# EAGLE design lixie_usb (EAGLE 7.6.0)
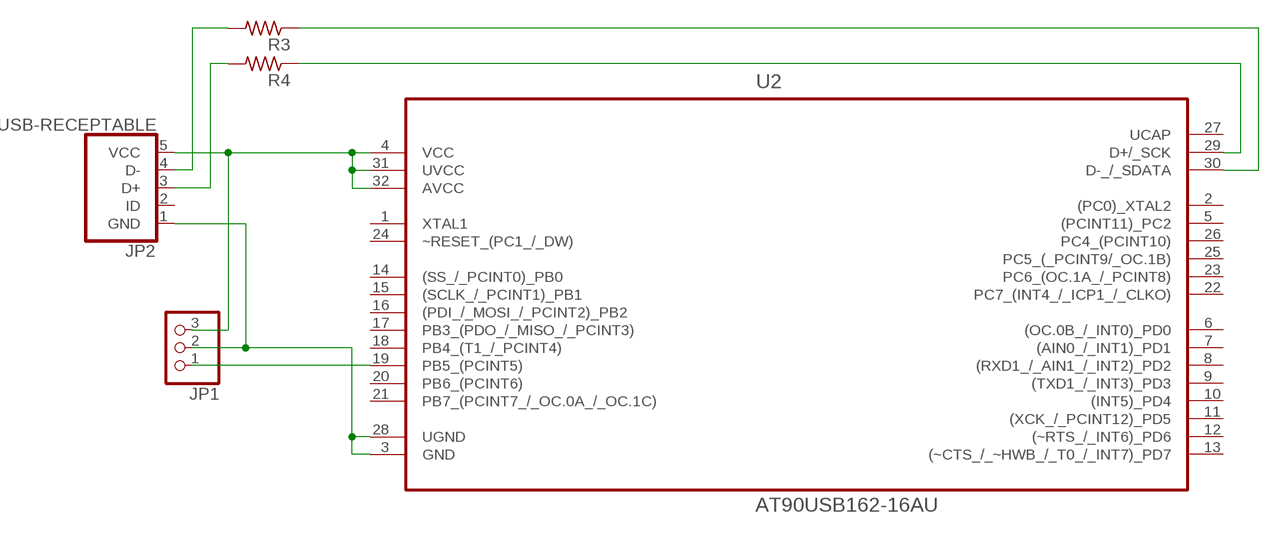
[diagram p0: schematic, sheet 1]

## Parts
JP1  PINHD-1X3  [1X03]
JP2  USB-RECEPTABLE  [FCI-10103594-0001LF]
R3  R-US_R0805  [R0805]
R4  R-US_R0805  [R0805]
U2  AT90USB162-16AU  [QFP80P900X900X120-32N]

## Nets
GND: JP1.2 JP2.1(GND) U2.3(GND) U2.28(UGND)
N$1: R3.1 U2.30(D-_/_SDATA)
N$4: JP2.4(D-) R3.2
N$5: JP2.3(D+) R4.2
N$7: R4.1 U2.29(D+/_SCK)
N$20: JP1.3 JP2.5(VCC) U2.4(VCC) U2.31(UVCC) U2.32(AVCC)
N$23: JP1.1 U2.19(PB5_(PCINT5))
Unconnected: JP2.2(ID) U2.1(XTAL1) U2.2((PC0)_XTAL2) U2.5((PCINT11)_PC2) U2.6((OC.0B_/_INT0)_PD0) U2.7((AIN0_/_INT1)_PD1) U2.8((RXD1_/_AIN1_/_INT2)_PD2) U2.9((TXD1_/_INT3)_PD3) U2.10((INT5)_PD4) U2.11((XCK_/_PCINT12)_PD5) U2.12((~RTS_/_INT6)_PD6) U2.13((~CTS_/_~HWB_/_T0_/_INT7)_PD7) U2.14((SS_/_PCINT0)_PB0) U2.15((SCLK_/_PCINT1)_PB1) U2.16((PDI_/_MOSI_/_PCINT2)_PB2) U2.17(PB3_(PDO_/_MISO_/_PCINT3)) U2.18(PB4_(T1_/_PCINT4)) U2.20(PB6_(PCINT6)) U2.21(PB7_(PCINT7_/_OC.0A_/_OC.1C)) U2.22(PC7_(INT4_/_ICP1_/_CLKO)) U2.23(PC6_(OC.1A_/_PCINT8)) U2.24(~RESET_(PC1_/_DW)) U2.25(PC5_(_PCINT9/_OC.1B)) U2.26(PC4_(PCINT10)) U2.27(UCAP)

## Library data of the parts
JP1 = adafruit:PINHD-1X3: PIN HEADER
JP2 = daspilker:USB-RECEPTABLE: USB Receptable
R3 R4 = resistor:R-US_: RESISTOR, American symbol
U2 = Atmel_By_element14_Batch_1-00:AT90USB162-16AU: 8-bit Microcontroller; MPN: AT90USB162-16AU; OC_FARNELL: 1455073; OC_NEWARK: 58M3868; PACKAGE: TQFP-32; SUPPLIER: Atmel

## Board
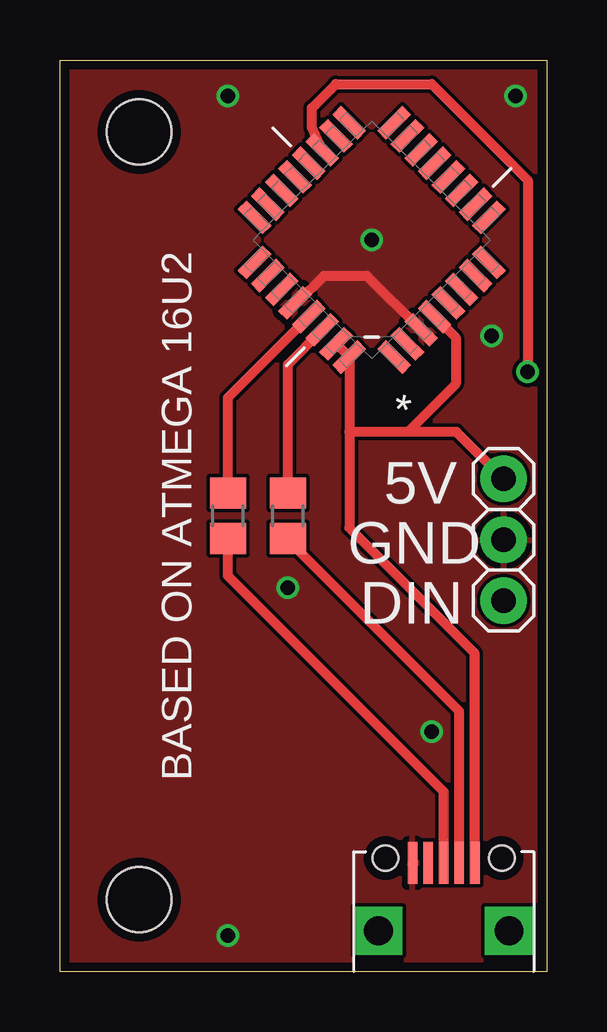
[diagram p1: board, top side]
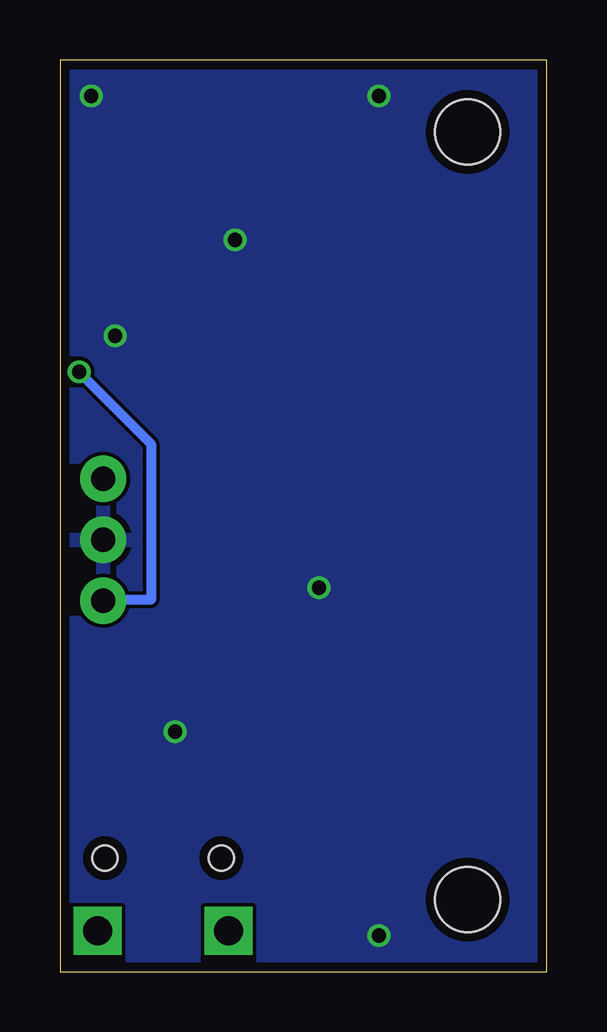
[diagram p2: board, bottom side, seen from below]

Size 20.3 x 38 mm. Coordinates in mm from the lower left corner, seen from the top.
Outline: 0,0 0,38 20.3,38 20.3,0 0,0
Copper layers (1*16): Top 0.0356mm / dielectric 1.5011mm / Bottom 0.0356mm
Design rules "LaenPCBOrder": minimum track width 6mil, minimum drill 13mil, track to track 6mil, track to pad 6mil, pad to pad 6mil, via to via 6mil, smd to smd 6mil, copper to edge 15mil, drill to drill 6mil, minimum pad ring 7mil, minimum via ring 7mil, stop-mask expansion 3mil, vias tented up to drill 0mil, thermal gap 10mil
Holes 2.7 mm at 3.3,35 3.3,3

### Footprints (pad centres in the part's own frame; a part is rotated, then mirrored left to right if it is on the bottom)
1X03 = drill 1.016 pad 1.93: 1 -2.54,0; 2 0,0; 3 2.54,0
FCI-10103594-0001LF = smd 0.4 x 1.75: 1 -1.3,4.525; 2 -0.65,4.525; 3 0,4.525; 4 0.65,4.525; 5 1.3,4.525 | drill 1.2 pad 2 square: P$3 -2.725,1.7; P$4 2.725,1.7 | hole 1.05: -2.425,4.73; 2.425,4.73
R0805 = smd 1.3 x 1.5: 1 -0.95,0; 2 0.95,0
QFP80P900X900X120-32N = smd 1.473 x 0.508: 1 -4.115,2.794; 2 -4.115,2.007; 3 -4.115,1.194; 4 -4.115,0.406; 5 -4.115,-0.406; 6 -4.115,-1.194; 7 -4.115,-2.007; 8 -4.115,-2.794; 17 4.115,-2.794; 18 4.115,-2.007; 19 4.115,-1.194; 20 4.115,-0.406; 21 4.115,0.406; 22 4.115,1.194; 23 4.115,2.007; 24 4.115,2.794 | smd 0.508 x 1.473: 9 -2.794,-4.115; 10 -2.007,-4.115; 11 -1.194,-4.115; 12 -0.406,-4.115; 13 0.406,-4.115; 14 1.194,-4.115; 15 2.007,-4.115; 16 2.794,-4.115; 25 2.794,4.115; 26 2.007,4.115; 27 1.194,4.115; 28 0.406,4.115; 29 -0.406,4.115; 30 -1.194,4.115; 31 -2.007,4.115; 32 -2.794,4.115

### Placement (x,y rotation side)
JP1  18.5,18 90 top
JP2  16,0 0 top
R3  9.5,19 270 top
R4  7,19 270 top
U2  13,30.5 135 top

### Tracks (layer width: path | path; a pad name or v marks a point on that pad's centre or on a via)
GND  (via drill 0.6)
  Top 0.406: U2.3 12.81,29 11,29 9.88,27.88 U2.28
  other vias: 19,36.5 7,1.5 7,36.5 13,30.5 9.5,16 15.5,10 18,26.5
  pour Top: 21,-1 0,-1 0,39 21,39
  pour Bottom: -0.5,39.5 21.5,39.5 21.5,-1.5 -0.5,-1.5
N$1
  Top 0.406: R3.1 9.5,25.31 U2.30
N$4
  Top 0.406: JP2.4 16.65,10.85 9.5,18 R3.2
N$5
  Top 0.406: JP2.3 16,7.5 7,16.5 R4.2
N$7
  Top 0.406: R4.1 7,23.93 U2.29
N$20
  Top 0.406: JP2.5 17.3,13.26 12.07,18.49 12.07,22.5 | 12.07,22.5 U2.32 U2.31 | U2.4 16.5,26.43 16.5,24.5 14.5,22.5 | 14.5,22.5 12.07,22.5 | JP1.3 16.54,22.5 14.5,22.5
N$23  (via drill 0.6)
  Top 0.406: U2.19 10.5,35.19 10.5,36 11.5,37 15.5,37 19.5,33 v19.5,25
  Bottom 0.406: v19.5,25 16.5,22 16.5,15.5 18.5,15.5 JP1.1

### Text on the board
tNames: 5V | BASED ON ATMEGA 16U2 | GND | DIN
tStop: LIXIE USB
tDocu: Lixie USB Adapter | Revision 1 | Layout by Connor Nishijima | Last Updated: / December 11th, 2016 | Released under the GPLv3 License